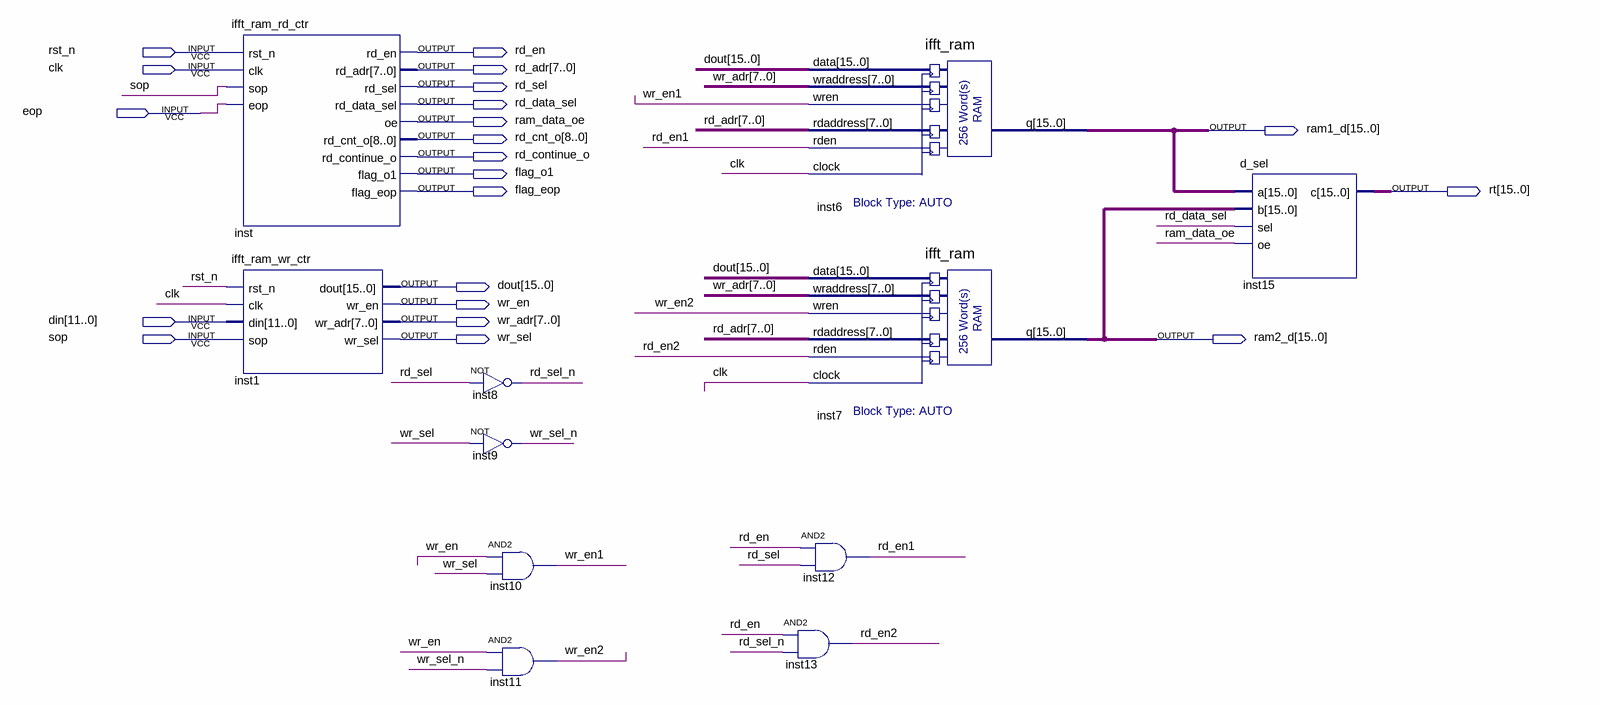
[diagram p0: schematic sheet]
// Quartus schematic cp_insert.bdf as structural Verilog: 11 symbols, 21 pins
module cp_insert (
  input  rst_n,
  input  clk,
  input  eop,
  input  [11:0] din,
  input  sop,
  output rd_en,
  output [7:0] rd_adr,
  output rd_sel,
  output rd_data_sel,
  output ram_data_oe,
  output [15:0] ram1_d,
  output [8:0] rd_cnt_o,
  output rd_continue_o,
  output flag_o1,
  output flag_eop,
  output [15:0] rt,
  output [15:0] dout,
  output wr_en,
  output [7:0] wr_adr,
  output wr_sel,
  output [15:0] ram2_d
);

  wire rd_en1, rd_en2, rd_sel_n, wr_en1, wr_en2, wr_sel_n;

  ifft_ram_rd_ctr inst (
    .rst_n(rst_n), .clk(clk), .sop(sop), .eop(eop), .rd_en(rd_en), .rd_adr(rd_adr), .rd_sel(rd_sel),
    .rd_data_sel(rd_data_sel), .oe(ram_data_oe), .rd_cnt_o(rd_cnt_o), .rd_continue_o(rd_continue_o),
    .flag_o1(flag_o1), .flag_eop(flag_eop));
  ifft_ram_wr_ctr inst1 (
    .rst_n(rst_n), .clk(clk), .din(din), .sop(sop), .dout(dout), .wr_en(wr_en), .wr_adr(wr_adr),
    .wr_sel(wr_sel));
  not inst8 (rd_sel_n, rd_sel);
  not inst9 (wr_sel_n, wr_sel);
  and inst10 (wr_en1, wr_en, wr_sel);
  and inst11 (wr_en2, wr_en, wr_sel_n);
  and inst13 (rd_en2, rd_en, rd_sel_n);
  ifft_ram inst6 (
    .data(dout), .wraddress(wr_adr), .wren(wr_en1), .rdaddress(rd_adr), .rden(rd_en1), .clock(clk), .q(ram1_d));
  ifft_ram inst7 (
    .data(dout), .wraddress(wr_adr), .wren(wr_en2), .rdaddress(rd_adr), .rden(rd_en2), .clock(clk), .q(ram2_d));
  and inst12 (rd_en1, rd_en, rd_sel);
  d_sel inst15 (.a(ram1_d), .b(ram2_d), .sel(rd_data_sel), .oe(ram_data_oe), .c(rt));
endmodule
